# EAGLE design OnOff (EAGLE 9.5.2)
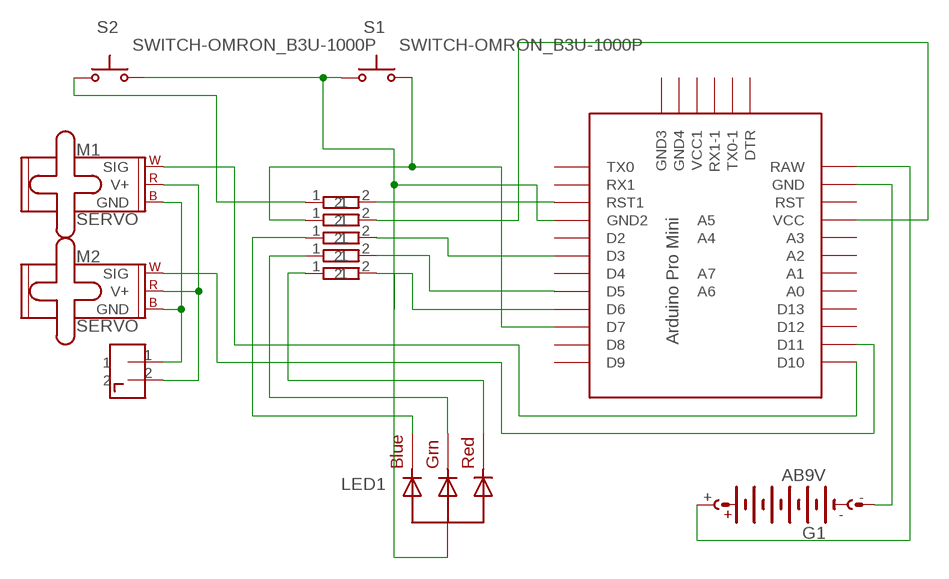
[diagram p0: schematic, sheet 1]

## Parts
CONNECTOR1  2PIN  [2PIN]
CONNECTOR2  RESISTER  [RESISTER_SOCKET]
CONNECTOR3  RESISTER  [RESISTER_SOCKET]
CONNECTOR4  RESISTER  [RESISTER_SOCKET]
CONNECTOR5  RESISTER  [RESISTER_SOCKET]
CONNECTOR6  RESISTER  [RESISTER_SOCKET]
G1  AB9V  [AB9V]
LED1  RGBLED_CA-5MM  [LED5MMRGB]
M1  SERVO  [1X03]
M2  SERVO  [1X03]
S1  SWITCH-OMRON_B3U-1000P  [SWITCH-OMRON_B3U-1000P]
S2  SWITCH-OMRON_B3U-1000P  [SWITCH-OMRON_B3U-1000P]
U$1  PRO-MINI-2  [PRO-MINI-2]

## Nets
N$1: G1.- U$1.GND
N$2: G1.+ U$1.RAW
N$3: CONNECTOR1.1 M1.3(GND) M2.3(GND)
N$4: CONNECTOR1.2 M1.2(V+) M2.2(V+)
N$5: CONNECTOR4.1 LED1.4(BLUE)
N$6: CONNECTOR5.1 LED1.3(GREEN)
N$7: CONNECTOR6.1 LED1.1(RED)
N$8: CONNECTOR6.2 U$1.D6
N$9: CONNECTOR5.2 U$1.D5
N$11: CONNECTOR4.2 U$1.D3
N$12: CONNECTOR3.1 S1.2(S) U$1.D7
N$13: CONNECTOR2.2 U$1.RST1
N$14: CONNECTOR2.1 S2.1(P)
N$15: M2.1(SIG) U$1.D11
N$16: M1.1(SIG) U$1.D10
N$17: LED1.2(VCC) S1.1(P) S2.2(S) U$1.GND1(GND2)
N$18: CONNECTOR3.2 U$1.VCC
Unconnected: U$1.A0 U$1.A1 U$1.A2 U$1.A3 U$1.A4 U$1.A5 U$1.A6 U$1.A7 U$1.D2 U$1.D4 U$1.D8 U$1.D9 U$1.D12 U$1.D13 U$1.DTR U$1.GND2(GND3) U$1.GND3(GND4) U$1.RST U$1.RX1 U$1.RX1-1 U$1.TX0 U$1.TX0-1 U$1.VCC1

## Library data of the parts
CONNECTOR1 = 2pin_large:2PIN: 2pin
CONNECTOR2-CONNECTOR6 = resistor:RESISTER: resister
G1 = battery:AB9V: 9-V BATTERY CLIP
LED1 = adafruit:RGBLED_CA: RGB LED, common-anode 5MM Staggered pins 5mm Piranha package http://www.ladyada.net/library/pcb/eaglelibrary.html
M1 M2 = SparkFun-Electromechanical:SERVO: Servo Motor 3-pin connector for a standard servo motor (voltage supply, ground, and control signal.) SparkFun Products Servo - Generic (Sub-Micro Size) <https://www.sparkfun.com/products/9065> (ROB-09065) Servo - Generic High Torque Continuous Rotation (Standard Size) <https://www.sparkfun.com/products/9347> (ROB-09347) Servo - Generic High Torque (Standard Size) <https://www.sparkfun.com/products/11965> (ROB-11965)
S1 S2 = 52101-101-REV-A:SWITCH-OMRON_B3U-1000P: SMD Tactile Switch - Ultra Small
U$1 = Arduino-clone:PRO-MINI-2: Arduino Pro Mini Layout 2 Sparkfun.com

## Board
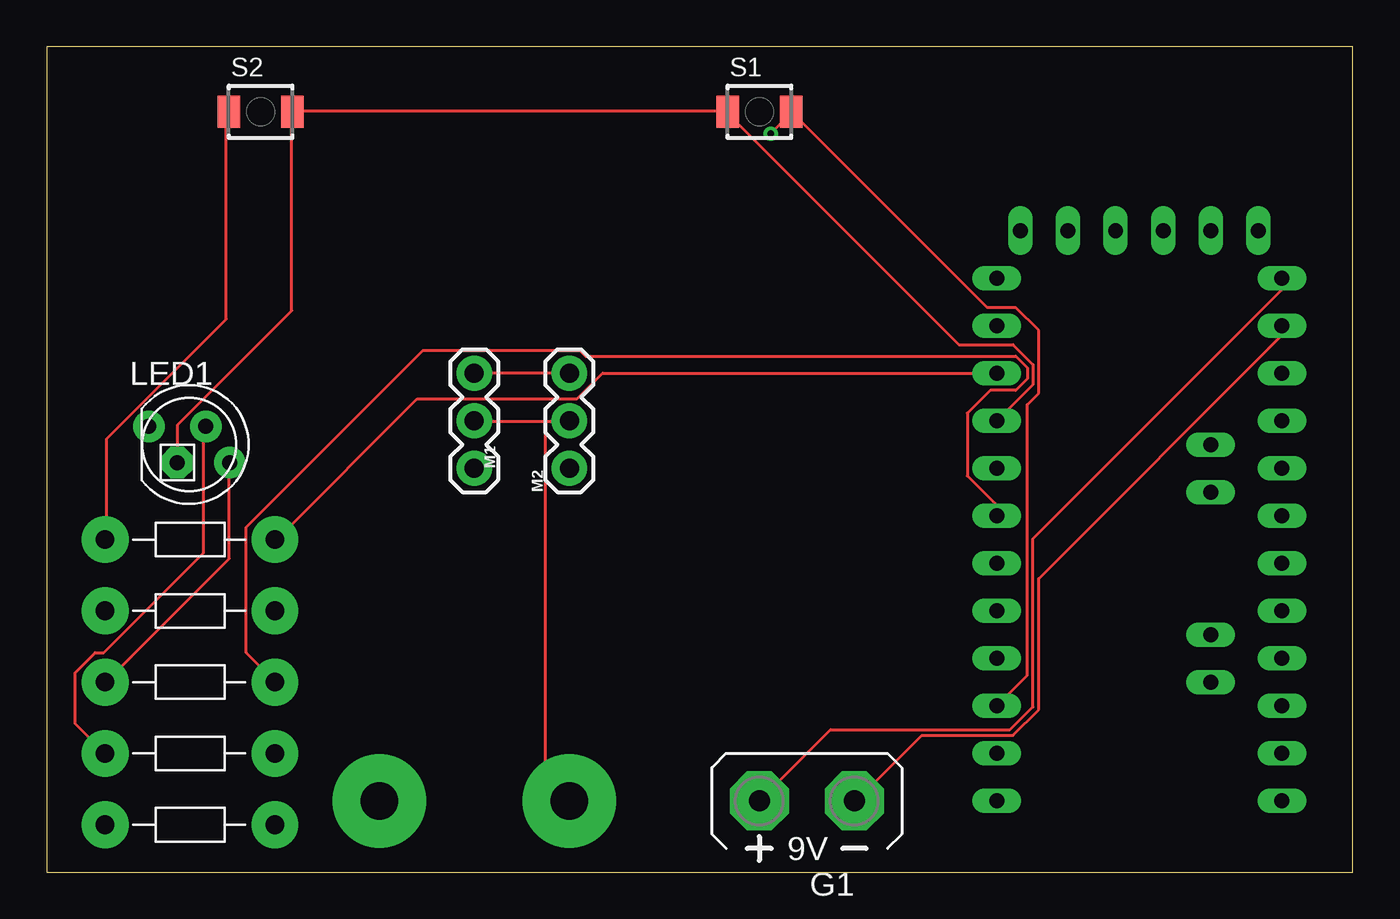
[diagram p1: board, top side]
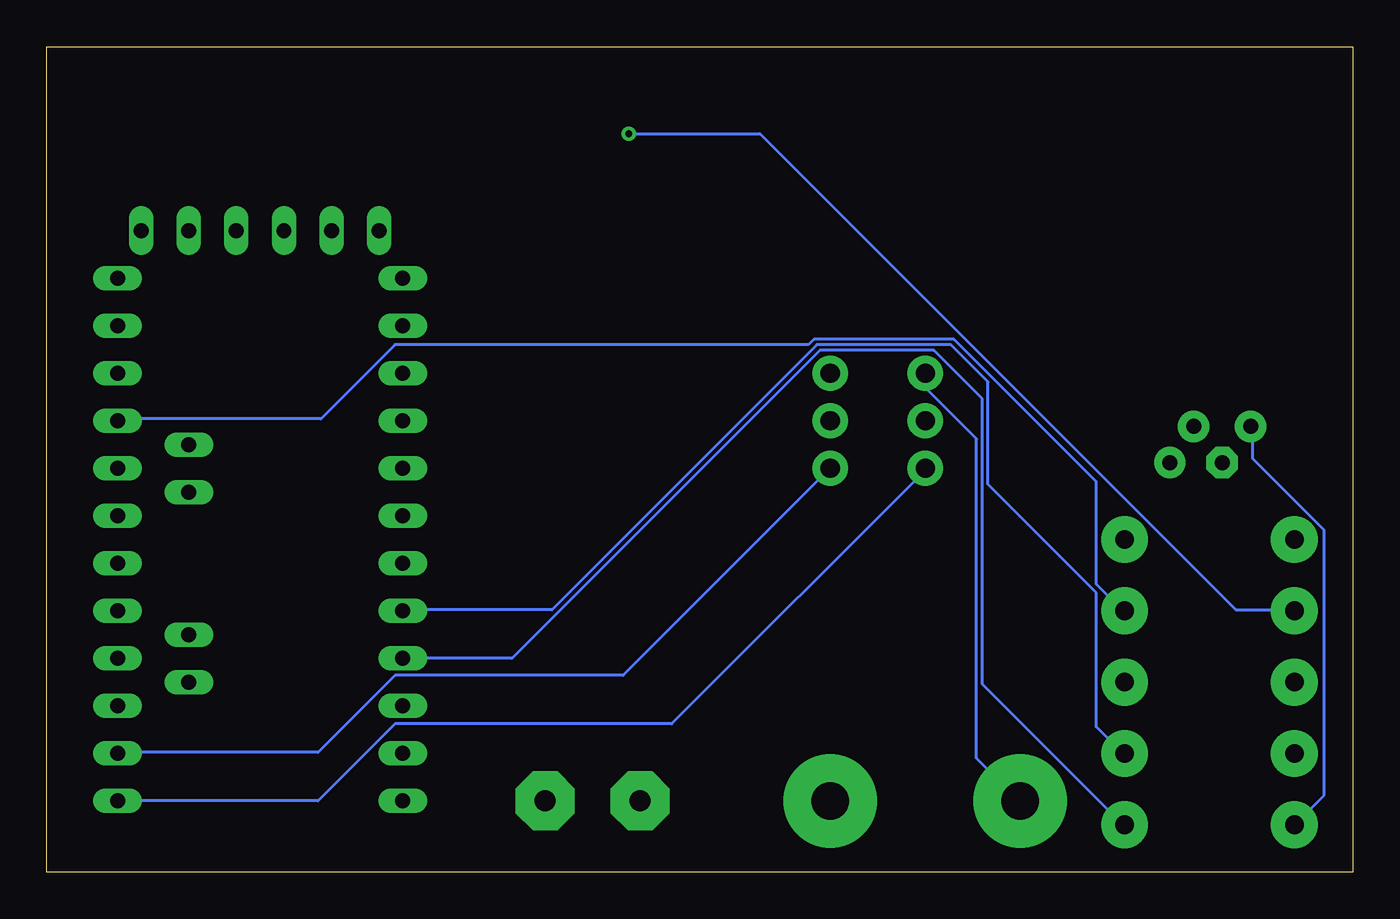
[diagram p2: board, bottom side, seen from below]

Size 69.83 x 44.12 mm. Coordinates in mm from the lower left corner, seen from the top.
Outline: 0,0 69.83,0 69.83,44.12 0,44.12 0,0
Copper layers (1*16): Top 0.035mm / dielectric 1.5mm / Bottom 0.035mm
Design rules "default": minimum track width 6mil, minimum drill 0.35mm, track to track 6mil, track to pad 6mil, pad to pad 6mil, via to via 6mil, smd to smd 6mil, copper to edge 40mil, drill to drill 6mil, minimum pad ring 10mil, minimum via ring 8mil, stop-mask expansion 4mil, vias tented up to drill 0mil, thermal gap 10mil

### Footprints (pad centres in the part's own frame; a part is rotated, then mirrored left to right if it is on the bottom)
2PIN = drill 2 pad 5: 1 0,0; 2 10.16,0
RESISTER_SOCKET = drill 1 pad 2.5: 1 -4.5,0; 2 4.58,0
AB9V = drill 1.118 pad 3.15 octagon: + 0,2.54; - 0,-2.54
LED5MMRGB = drill 0.8 pad 1.676: 1 -2.159,0.968; 3 0.889,0.968; 4 2.159,-0.968 | drill 0.8 pad 1.676 octagon: 2 -0.635,-0.968
1X03 = drill 1.016 pad 1.88: 1 0,0; 2 2.54,0; 3 5.08,0
SWITCH-OMRON_B3U-1000P = smd 1.2 x 1.7: 1 -1.7,0; 2 1.7,0
PRO-MINI-2 = drill 0.8 long: A0 6.35,2.54; A1 6.35,0; A2 6.35,-2.54; A3 6.35,-5.08; A4 2.54,1.27; A5 2.54,3.81; A6 2.54,-8.89; A7 2.54,-6.35; D2 -8.89,2.54; D3 -8.89,0; D4 -8.89,-2.54; D5 -8.89,-5.08; D6 -8.89,-7.62; D7 -8.89,-10.16; D8 -8.89,-12.7; D9 -8.89,-15.24; D10 6.35,-15.24; D11 6.35,-12.7; D12 6.35,-10.16; D13 6.35,-7.62; DTR 5.08,15.24; GND 6.35,10.16; GND1 -8.89,5.08; GND2 -7.62,15.24; GND3 -5.08,15.24; RAW 6.35,12.7; RST 6.35,7.62; RST1 -8.89,7.62; RX1 -8.89,10.16; RX1-1 0,15.24; TX0 -8.89,12.7; TX0-1 2.54,15.24; VCC 6.35,5.08; VCC1 -2.54,15.24

### Placement (x,y rotation side)
CONNECTOR1  17.78,3.81 0 top
CONNECTOR2  7.62,17.78 0 top
CONNECTOR3  7.62,13.97 0 top
CONNECTOR4  7.62,10.16 0 top
CONNECTOR5  7.62,6.35 0 top
CONNECTOR6  7.62,2.54 0 top
G1  40.64,3.81 90 top
LED1  7.62,22.86 0 top
M1  22.86,21.59 90 top
M2  27.94,21.59 90 top
S1  38.1,40.64 0 top
S2  11.43,40.64 0 top
U$1  59.69,19.05 0 top

### Tracks (layer width: path | path; a pad name or v marks a point on that pad's centre or on a via)
N$1
  Top 0.152: U$1.GND 65.99,29.11 65.99,28.65 53.03,15.7 53.03,8.69 51.66,7.32 46.79,7.32 43.28,3.81 G1.-
N$2
  Top 0.152: G1.+ 41.91,7.62 51.51,7.62 52.73,8.84 52.73,17.83 65.99,31.09 65.99,31.7 U$1.RAW
N$3
  Top 0.152: M2.3 M1.3
  Bottom 0.152: M1.3 22.86,25.91 20.12,23.16 20.12,6.1 17.83,3.81 CONNECTOR1.1
N$4
  Top 0.152: 26.67,24.08 27.89,24.08 M2.2 | 26.67,24.08 22.86,24.08 M1.2 | 26.67,24.08 26.67,5.03 27.89,3.81 CONNECTOR1.2
N$5
  Top 0.152: LED1.4 9.75,21.79 9.75,16.76 3.2,10.21 CONNECTOR4.1
N$6
  Top 0.152: LED1.3 8.38,23.77 8.38,17.07 3.05,11.73 2.59,11.73 1.52,10.67 1.52,7.92 3.05,6.4 CONNECTOR5.1
N$7
  Bottom 0.152: LED1.1 5.33,23.77 5.33,22.1 1.52,18.29 1.52,4.12 3.05,2.59 CONNECTOR6.1
N$8
  Bottom 0.152: U$1.D6 44.96,11.43 28.5,27.89 22.4,27.89 19.81,25.3 19.81,10.06 12.34,2.59 CONNECTOR6.2
N$9
  Bottom 0.152: U$1.D5 50.75,14.02 42.82,14.02 28.65,28.19 21.49,28.19 19.51,26.21 19.51,20.73 13.72,14.94 13.72,7.77 12.34,6.4 CONNECTOR5.2
N$11
  Top 0.152: U$1.D3 50.75,19.05 50.75,19.66 49.23,21.18 49.23,24.54 50.44,25.76 51.82,25.76 52.43,26.36 52.43,26.98 51.82,27.58 28.8,27.58 28.5,27.89 20.12,27.89 10.67,18.44 10.67,11.73 12.19,10.21 CONNECTOR4.2
N$12  (via drill 0.35)
  Top 0.152: U$1.D7 52.43,10.52 52.43,24.99 53.03,25.6 53.03,28.96 51.82,30.18 50.29,30.18 39.93,40.54 S1.2 39.78,40.54 v38.71,39.47
  Bottom 0.152: v38.71,39.47 31.7,39.47 6.25,14.02 3.2,14.02 CONNECTOR3.1
N$13
  Top 0.152: U$1.RST1 29.72,26.67 28.35,25.3 19.81,25.3 12.34,17.83 CONNECTOR2.2
N$14
  Top 0.152: S2.1 9.6,40.54 9.6,29.57 3.2,23.16 3.2,17.83 CONNECTOR2.1
N$15
  Bottom 0.152: M2.1 39.01,10.52 51.21,10.52 55.32,6.4 65.99,6.4 U$1.D11
N$16
  Bottom 0.152: U$1.D10 55.32,3.81 51.21,7.92 36.42,7.92 22.86,21.49 M1.1
N$17
  Top 0.152: LED1.2 7.01,21.95 7.01,23.93 13.11,30.02 13.11,40.54 S2.2 13.26,40.69 36.27,40.69 S1.1 36.42,40.54 48.77,28.19 51.66,28.19 52.73,27.13 52.73,26.06 U$1.GND1
N$18
  Bottom 0.152: U$1.VCC 65.99,24.23 55.17,24.23 51.21,28.19 29.11,28.19 28.8,28.5 21.34,28.5 13.72,20.88 13.72,15.39 12.34,14.02 CONNECTOR3.2